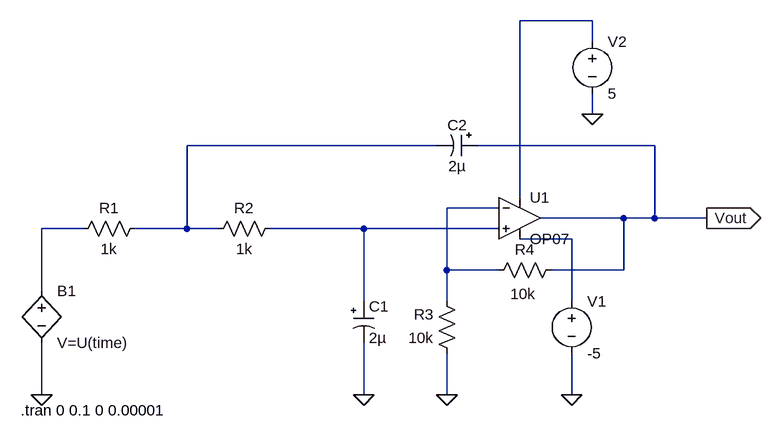
[diagram p0: schematic EC5030_Design Project_2021E171_Design1.asc]
EC5030_Design Project_2021E171_Design1.asc, the LTspice schematic file:
Version 4
SHEET 1 1056 680
WIRE 768 -624 656 -624
WIRE 768 -592 768 -624
WIRE 768 -480 768 -512
WIRE 528 -432 144 -432
WIRE 864 -432 592 -432
WIRE 656 -352 656 -624
WIRE 624 -336 544 -336
WIRE 816 -320 688 -320
WIRE 864 -320 864 -432
WIRE 864 -320 816 -320
WIRE 944 -320 864 -320
WIRE -16 -304 -80 -304
WIRE 144 -304 144 -432
WIRE 144 -304 64 -304
WIRE 192 -304 144 -304
WIRE 416 -304 272 -304
WIRE 624 -304 416 -304
WIRE 736 -288 656 -288
WIRE 544 -240 544 -336
WIRE 624 -240 544 -240
WIRE 816 -240 816 -320
WIRE 816 -240 704 -240
WIRE -80 -208 -80 -304
WIRE 416 -192 416 -304
WIRE 544 -192 544 -240
WIRE 736 -192 736 -288
WIRE -80 -48 -80 -128
WIRE 416 -48 416 -128
WIRE 544 -48 544 -112
WIRE 736 -48 736 -112
FLAG 416 -48 0
FLAG 544 -48 0
FLAG 944 -320 Vout
IOPIN 944 -320 Out
FLAG -80 -48 0
FLAG 768 -480 0
FLAG 736 -48 0
SYMBOL res 80 -320 R90
WINDOW 0 0 56 VBottom 2
WINDOW 3 32 56 VTop 2
SYMATTR InstName R1
SYMATTR Value 1k
SYMBOL res 288 -320 R90
WINDOW 0 0 56 VBottom 2
WINDOW 3 32 56 VTop 2
SYMATTR InstName R2
SYMATTR Value 1k
SYMBOL res 560 -96 R180
WINDOW 0 36 76 Left 2
WINDOW 3 36 40 Left 2
SYMATTR InstName R3
SYMATTR Value 10k
SYMBOL res 720 -256 R90
WINDOW 0 0 56 VBottom 2
WINDOW 3 37 59 VTop 2
SYMATTR InstName R4
SYMATTR Value 10k
SYMBOL polcap 400 -192 R0
SYMATTR InstName C1
SYMATTR Value 2µ
SYMBOL polcap 592 -448 R90
WINDOW 0 0 32 VBottom 2
WINDOW 3 32 32 VTop 2
SYMATTR InstName C2
SYMATTR Value 2µ
SYMBOL OpAmps\\OP07 656 -384 R0
SYMATTR InstName U1
SYMBOL bv -80 -224 R0
SYMATTR InstName B1
SYMATTR Value V=U(time)
SYMBOL voltage 736 -208 R0
SYMATTR InstName V1
SYMATTR Value -5
SYMBOL voltage 768 -608 R0
SYMATTR InstName V2
SYMATTR Value 5
TEXT -112 -24 Left 2 !.tran 0 0.1 0 0.00001

The netlist it stands for:
* EC5030_Design Project_2021E171_Design1.asc
R1 N002 N004 1k
R2 N005 N002 1k
R3 0 N003 10k
R4 Vout N003 10k
C1 N005 0 2µ
C2 Vout N002 2µ
XU1 N005 N003 N001 N006 Vout LT1001  ; OP07, pins In+ In- V+ V- OUT
B1 N004 0 V=U(time)
V1 N006 0 -5
V2 N001 0 5
.tran 0 0.1 0 0.00001
.lib LTC.lib
.backanno
.end